# Altium schematic sheet SCH.SchDoc
size C
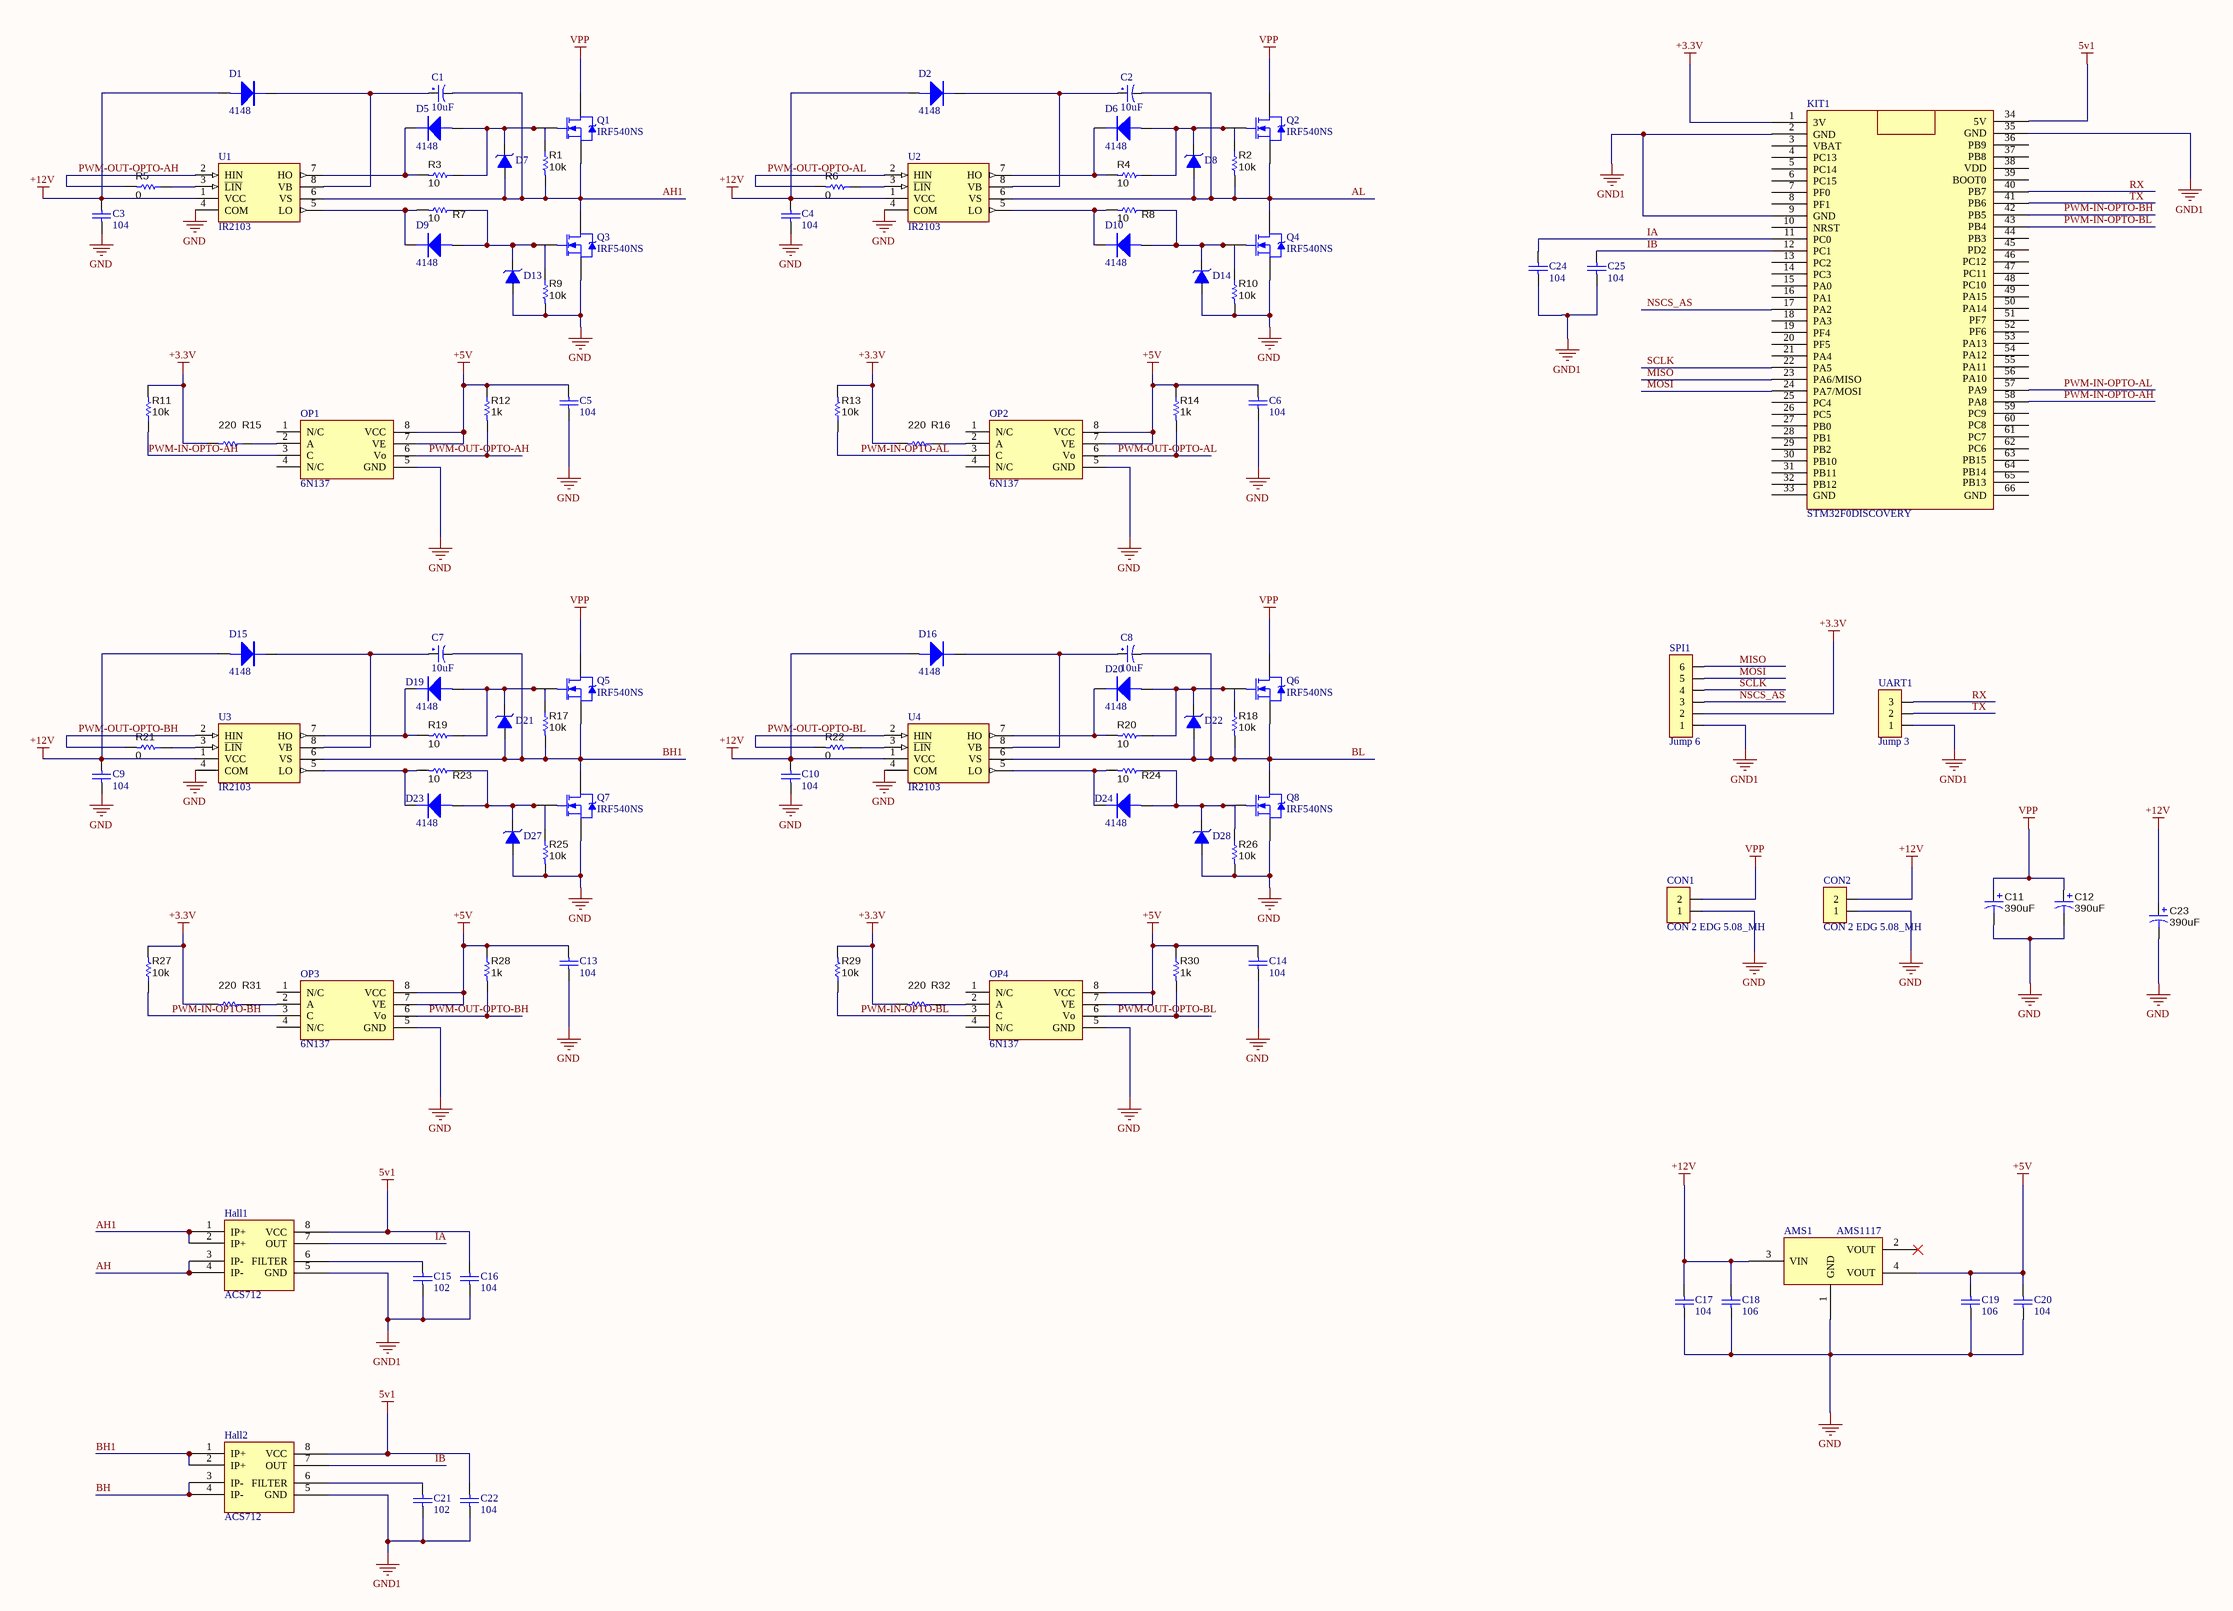
[diagram p0: SCH.SchDoc]

## Parts
AMS1  AMS1117  [SOT223]
C1  10uF  [CP1/2]
C2  10uF  [CP1/2]
C3  104  [TU_SMD_0805]
C4  104  [TU_SMD_0805]
C5  104  [TU_SMD_0805]
C6  104  [TU_SMD_0805]
C7  10uF  [CP1/2]
C8  10uF  [CP1/2]
C9  104  [TU_SMD_0805]
C10  104  [TU_SMD_0805]
C11  390uF  [CAP_12.5 X 25]
C12  390uF  [CAP_12.5 X 25]
C13  104  [TU_SMD_0805]
C14  104  [TU_SMD_0805]
C15  102  [TU_SMD_0805]
C16  104  [TU_SMD_0805]
C17  104  [TU_SMD_0805]
C18  106  [TU_SMD_0805]
C19  106  [TU_SMD_0805]
C20  104  [TU_SMD_0805]
C21  102  [TU_SMD_0805]
C22  104  [TU_SMD_0805]
C23  390uF  [CP1/3.0]
C24  104  [TU_SMD_0805]
C25  104  [TU_SMD_0805]
CON1  CON 2 EDG 5.08_MH  [CON 2 EDG 5.08]
CON2  CON 2 EDG 5.08_MH  [CON 2 EDG 5.08]
D1  4148  [Diode Zener 1N5363B 5W 30V]
D2  4148  [Diode Zener 1N5363B 5W 30V]
D5  4148  [Diode Zener 1N5363B 5W 30V]
D6  4148  [Diode Zener 1N5363B 5W 30V]
D7  (no value)  [DO-35]
D8  (no value)  [DO-35]
D9  4148  [Diode Zener 1N5363B 5W 30V]
D10  4148  [Diode Zener 1N5363B 5W 30V]
D13  (no value)  [DO-35]
D14  (no value)  [DO-35]
D15  4148  [Diode Zener 1N5363B 5W 30V]
D16  4148  [Diode Zener 1N5363B 5W 30V]
D19  4148  [Diode Zener 1N5363B 5W 30V]
D20  4148  [Diode Zener 1N5363B 5W 30V]
D21  (no value)  [DO-35]
D22  (no value)  [DO-35]
D23  4148  [Diode Zener 1N5363B 5W 30V]
D24  4148  [Diode Zener 1N5363B 5W 30V]
D27  (no value)  [DO-35]
D28  (no value)  [DO-35]
Hall1  ACS712  [SOP 8]
Hall2  ACS712  [SOP 8]
KIT1  STM32F0DISCOVERY  [STM32F0DISCOVERY-6N137]
OP1  6N137 DIP8 Opto 10Mbit  [DIP8]  (value not drawn)
OP2  6N137 DIP8 Opto 10Mbit  [DIP8]  (value not drawn)
OP3  6N137 DIP8 Opto 10Mbit  [DIP8]  (value not drawn)
OP4  6N137 DIP8 Opto 10Mbit  [DIP8]  (value not drawn)
Q1  IRF540NS  [D2PAK_M_1]
Q2  IRF540NS  [D2PAK_M_1]
Q3  IRF540NS  [D2PAK_M_1]
Q4  IRF540NS  [D2PAK_M_1]
Q5  IRF540NS  [D2PAK_M_1]
Q6  IRF540NS  [D2PAK_M_1]
Q7  IRF540NS  [D2PAK_M_1]
Q8  IRF540NS  [D2PAK_M_1]
R1  10k  [Tro SMD 0805]
R2  10k  [Tro SMD 0805]
R3  10  [Tro SMD 0805]
R4  10  [Tro SMD 0805]
R5  0  [Tro SMD 0805]
R6  0  [Tro SMD 0805]
R7  10  [Tro SMD 0805]
R8  10  [Tro SMD 0805]
R9  10k  [Tro SMD 0805]
R10  10k  [Tro SMD 0805]
R11  10k  [Tro SMD 0805]
R12  1k  [Tro SMD 0805]
R13  10k  [Tro SMD 0805]
R14  1k  [Tro SMD 0805]
R15  220  [Tro SMD 0805]
R16  220  [Tro SMD 0805]
R17  10k  [Tro SMD 0805]
R18  10k  [Tro SMD 0805]
R19  10  [Tro SMD 0805]
R20  10  [Tro SMD 0805]
R21  0  [Tro SMD 0805]
R22  0  [Tro SMD 0805]
R23  10  [Tro SMD 0805]
R24  10  [Tro SMD 0805]
R25  10k  [Tro SMD 0805]
R26  10k  [Tro SMD 0805]
R27  10k  [Tro SMD 0805]
R28  1k  [Tro SMD 0805]
R29  10k  [Tro SMD 0805]
R30  1k  [Tro SMD 0805]
R31  220  [Tro SMD 0805]
R32  220  [Tro SMD 0805]
SPI1  Jump 6  [ZH 1.5 6P]
U1  IR2103  [SOP 8]
U2  IR2103  [SOP 8]
U3  IR2103  [SOP 8]
U4  IR2103  [SOP 8]
UART1  Jump 3  [Jump 3]

## Nets
5v1: C16.2 C22.2 Hall1.8(VCC) Hall2.8(VCC) KIT1.34(5V)
+3.3V: KIT1.1(3V) R11.2 R13.2 R15.2 R16.2 R27.2 R29.2 R31.2 R32.2 SPI1.2
+5V: AMS1.4(VOUT) C5.2 C6.2 C13.2 C14.2 C19.2 C20.2 OP1.7(VE) OP1.8(VCC) OP2.7(VE) OP2.8(VCC) OP3.7(VE) OP3.8(VCC) OP4.7(VE) OP4.8(VCC) R12.1 R14.1 R28.1 R30.1
+12V: AMS1.3(VIN) C3.2 C4.2 C9.2 C10.2 C17.2 C18.2 C23.1(+) CON2.2 D1.1 D2.1 D15.1 D16.1 U1.1(VCC) U2.1(VCC) U3.1(VCC) U4.1(VCC)
GND: AMS1.1(GND) C3.1 C4.1 C5.1 C6.1 C9.1 C10.1 C11.2(-) C12.2(-) C13.1 C14.1 C17.1 C18.1 C19.1 C20.1 C23.2(-) CON1.1 CON2.1 D13.1(A) D14.1(A) D27.1(A) D28.1(A) OP1.5(GND) OP2.5(GND) OP3.5(GND) OP4.5(GND) Q3.3(S) Q4.3(S) Q7.3(S) Q8.3(S) R9.2 R10.2 R25.2 R26.2 U1.4(COM) U2.4(COM) U3.4(COM) U4.4(COM)
GND1: C15.1 C16.1 C21.1 C22.1 C24.1 C25.1 Hall1.5(GND) Hall2.5(GND) KIT1.2(GND) KIT1.9(GND) KIT1.35(GND) SPI1.1 UART1.1
VPP: C11.1(+) C12.1(+) CON1.2 Q1.2(D) Q2.2(D) Q5.2(D) Q6.2(D)
AH: Hall1.3(IP-) Hall1.4(IP-)
AH1: C1.2 D7.1(A) Hall1.1(IP+) Hall1.2(IP+) Q1.3(S) Q3.2(D) R1.2 U1.6(VS)
AL: C2.2 D8.1(A) Q2.3(S) Q4.2(D) R2.2 U2.6(VS)
BH: Hall2.3(IP-) Hall2.4(IP-)
BH1: C7.2 D21.1(A) Hall2.1(IP+) Hall2.2(IP+) Q5.3(S) Q7.2(D) R17.2 U3.6(VS)
BL: C8.2 D22.1(A) Q6.3(S) Q8.2(D) R18.2 U4.6(VS)
IA: C24.2 Hall1.7(OUT) KIT1.11(PC0)
IB: C25.2 Hall2.7(OUT) KIT1.12(PC1)
MISO: KIT1.23(PA6/MISO) SPI1.6
MOSI: KIT1.24(PA7/MOSI) SPI1.5
NSCS_AS: KIT1.17(PA2) SPI1.3
PWM-IN-OPTO-AH: KIT1.58(PA8) OP1.3(C) R11.1
PWM-IN-OPTO-AL: KIT1.57(PA9) OP2.3(C) R13.1
PWM-IN-OPTO-BH: KIT1.42(PB5) OP3.3(C) R27.1
PWM-IN-OPTO-BL: KIT1.43(PB4) OP4.3(C) R29.1
PWM-OUT-OPTO-AH: OP1.6(Vo) R5.2 R12.2 U1.2(HIN)
PWM-OUT-OPTO-AL: OP2.6(Vo) R6.2 R14.2 U2.2(HIN)
PWM-OUT-OPTO-BH: OP3.6(Vo) R21.2 R28.2 U3.2(HIN)
PWM-OUT-OPTO-BL: OP4.6(Vo) R22.2 R30.2 U4.2(HIN)
RX: KIT1.40(PB7) UART1.3
SCLK: KIT1.22(PA5) SPI1.4
TX: KIT1.41(PB6) UART1.2
NetC1_1: C1.1 D1.2 U1.8(VB)
NetC2_1: C2.1 D2.2 U2.8(VB)
NetC7_1: C7.1 D15.2 U3.8(VB)
NetC8_1: C8.1 D16.2 U4.8(VB)
NetC15_2: C15.2 Hall1.6(FILTER)
NetC21_2: C21.2 Hall2.6(FILTER)
NetD5_1: D5.1 D7.2(K) Q1.1(G) R1.1 R3.1
NetD5_2: D5.2 R3.2 U1.7(HO)
NetD6_1: D6.1 D8.2(K) Q2.1(G) R2.1 R4.1
NetD6_2: D6.2 R4.2 U2.7(HO)
NetD9_1: D9.1 D13.2(K) Q3.1(G) R7.1 R9.1
NetD9_2: D9.2 R7.2 U1.5(LO)
NetD10_1: D10.1 D14.2(K) Q4.1(G) R8.1 R10.1
NetD10_2: D10.2 R8.2 U2.5(LO)
NetD19_1: D19.1 D21.2(K) Q5.1(G) R17.1 R19.1
NetD19_2: D19.2 R19.2 U3.7(HO)
NetD20_1: D20.1 D22.2(K) Q6.1(G) R18.1 R20.1
NetD20_2: D20.2 R20.2 U4.7(HO)
NetD23_1: D23.1 D27.2(K) Q7.1(G) R23.1 R25.1
NetD23_2: D23.2 R23.2 U3.5(LO)
NetD24_1: D24.1 D28.2(K) Q8.1(G) R24.1 R26.1
NetD24_2: D24.2 R24.2 U4.5(LO)
NetOP1_2: OP1.2(A) R15.1
NetOP2_2: OP2.2(A) R16.1
NetOP3_2: OP3.2(A) R31.1
NetOP4_2: OP4.2(A) R32.1
NetR5_1: R5.1 U1.3(~{LIN})
NetR6_1: R6.1 U2.3(~{LIN})
NetR21_1: R21.1 U3.3(~{LIN})
NetR22_1: R22.1 U4.3(~{LIN})

Not connected (* = marked no-connect by the designer): AMS1 2(VOUT)*; KIT1 3(VBAT) 4(PC13) 5(PC14) 6(PC15) 7(PF0) 8(PF1) 10(NRST) 13(PC2) 14(PC3) 15(PA0) 16(PA1) 18(PA3) 19(PF4) 20(PF5) 21(PA4) 25(PC4) 26(PC5) 27(PB0) 28(PB1) 29(PB2) 30(PB10) 31(PB11) 32(PB12) 33(GND) 36(PB9) 37(PB8) 38(VDD) 39(BOOT0) 44(PB3) 45(PD2) 46(PC12) 47(PC11) 48(PC10) 49(PA15) 50(PA14) 51(PF7) 52(PF6) 53(PA13) 54(PA12) 55(PA11) 56(PA10) 59(PC9) 60(PC8) 61(PC7) 62(PC6) 63(PB15) 64(PB14) 65(PB13) 66(GND); OP1 1(N/C) 4(N/C); OP2 1(N/C) 4(N/C); OP3 1(N/C) 4(N/C); OP4 1(N/C) 4(N/C)

## Library data of the parts
AMS1 = AMS1117-3.3V SOT223
C1 C2 C7 C8 = TU_HOA_4.7uF_50V_MH: Cap P  0,1uF < 22uF , 16 - 50V; Value: 10uF/50V; Description 1: 10 => 220uF/6,3V/10V - 10uF => 100uF/16V; Description 2: 0,1uF => 33uF/50V - 10uF => 22uF/63V; Description 3: 0,47uF => 10uF/100V
C3-C6 C9 C10 C13-C22 C24 C25 = Capacitor 0805: Ceramic Chip Capacitor - Standard; Note: Footprint corresponds to dimensions for bulk cassette packaging. This case size has tightened tolerances.; Published: 17-Jul-2002; LatestRevisionDate: 19-Mar-2004; LatestRevisionNote: Silkscreen size reduced.; DatasheetDocument: Mar-2001; PackageDocument: Mar-2001; PackageReference: 0805; Publisher: Altium Limited; Code_JEITA: 0805; Code_IPC: 2012[0805]; ComponentLink1Description: Manufacturer Link; ComponentLink1URL: http://www.kemet.com/; ComponentLink2Description: Datasheet; ComponentLink2URL: http://www.kemet.com/kemet/web/homepage/kechome.nsf/vapubfilesname/F3102TA.pdf/$file/F3102TA.pdf
  C3-C6 C9 C10 C13 C14 C16 C17 C20 C22 C24 C25: Value: 104
  C15 C21: Value: 102
  C18 C19: Value: 106
C11 C12 = Capacitor TuHoa: CAP ALUM 390UF 20% 50V RADIAL; PartNumber: UHW1H391MPD6; Manufacturer: Nichicon; Polarized: Y; U/M: EA; Cap_F: 0.000390; Tolerance_%: 20; Value1: Unknown; VDC_V: 50; TaMin_C: -40; TaMax_C: 105; Cap_Case: 10x22; AEC Category: Q200; AEC Qualified: N; CompType: Capacitor; SymbolVersion: 2008-07-09; Value: 390uF; PackageReference: 10x22; RoHS: Y; Value2: 50V; MountType: TH; Technology: AL; Series: ZL; Publisher: Texas Instruments; LatestRevisionDate: 2015-12-17; ComponentLink1Description: Datasheet link; ComponentLink1URL: http://nichicon-us.com/english/products/pdfs/e-uhw.pdf; Supplier 1: Digi-Key; Supplier Part Number 1: 493-6885-ND; AEC Grade: N/A; ValueDisplayed: 390uF
C23 = Capacitor TuHoa: PartNumber: UHW1H391MPD6; Manufacturer: Nichicon; Polarized: Y; U/M: EA; Cap_F: 0.000390; Tolerance_%: 20; Value1: Unknown; VDC_V: 50; Value2: 50V; TaMin_C: -40; TaMax_C: 105; Cap_Case: 10x22; AEC Category: Q200; AEC Qualified: N; CompType: Capacitor; SymbolVersion: 2008-07-09; Value: 390uF; PackageReference: 10x22; RoHS: Y; MountType: TH; Technology: AL; Series: ZL; Publisher: Texas Instruments; LatestRevisionDate: 2015-12-17; ComponentLink1Description: Datasheet link; ComponentLink1URL: http://nichicon-us.com/english/products/pdfs/e-uhw.pdf; Supplier 1: Digi-Key; Supplier Part Number 1: 493-6885-ND; AEC Grade: N/A; ValueDisplayed: 390uF
CON1 CON2 = CON 2 EDG 5.08_MH: CON 2 EDG 5.08 (xanh cong)
D1 D2 D5 D6 D9 D10 D15 D16 D19 D20 D23 D24 = Diode 1N4148 DO35 450mA 100V ( 1N4148 DIP)_MH: Diode 1N4148 DO35 450mA 100V ( 1N4148 DIP)
D7 D8 D13 D14 D21 D22 D27 D28 = Diode Zener
OP1-OP4 = 6N137: 6N137 DIP8 Opto 10Mbit/s
Q1-Q8 = IRF540NS: HEXFET Power MOSFET; Published: 8-Jun-2000; LatestRevisionDate: 20-Nov-2009; LatestRevisionNote: IPC-7351 Footprint Added.; DatasheetVersion: May-1998; PackageReference: D2PAK; Publisher: Altium Limited; PackageDescription: 3-Pin Transistor Outline Package 2.54 mm Pitch, 15.1 mm Lead Span; ComponentLink1Description: Manufacturer Link; ComponentLink1URL: http://www.irf.com/; ComponentLink2Description: Datasheet; ComponentLink2URL: http://www.irf.com/product-info/datasheets/data/irf540ns.pdf; Supplier 1: Farnell
R1-R32 = R nho: RES, 100, 1%, 0.1 W, 0402; PartNumber: ERJ-2RKF1000X; Manufacturer: Panasonic; CompType: Resistor; Res_ohm: 100; Value_Code: 100R; Tolerance_%: 1; Power_W: 0.1; Value2: 0.1W; VDC_V: 50; TempCo: 100 ppm/C; EIA_Code: E96; U/M: EA; AEC Category: Q200; SymbolVersion: 2009-05-29; PackageReference: 0402; RoHS: Y; Value1: 1%; MountType: SMT; Technology: Thick Film; Published: 2008-06-26; Publisher: Texas Instruments; LatestRevisionDate: 2016-01-08; ComponentLink1Description: Datasheet link; ComponentLink1URL: http://industrial.panasonic.com/www-data/pdf/AOA0000/AOA0000CE2.pdf; Supplier 1: Digi-Key; Supplier Part Number 1: P100LCT-ND; Supplier 2: Mouser; Supplier Part Number 2: 667-ERJ-2RKF1000X; Supplier 3: Farnell; Supplier Part Number 3: 2304034; AEC Qualified: ?
  R1 R2 R9-R11 R13 R17 R18 R25-R27 R29: Value: 10k
  R3 R4 R7 R8 R19 R20 R23 R24: Value: 10
  R5 R6 R21 R22: Value: 0
  R12 R14 R28 R30: Value: 1k
  R15 R16 R31 R32: Value: 220
SPI1 = Jump 6: Jump 6P 2.54
U1-U4 = IR2103: High and Low Side Driver; Published: 8-Jun-2000; LatestRevisionDate: 04-Mar-2005; LatestRevisionNote: Stylized 3D Model Added.; DatasheetVersion: PD600451; PackageReference: PDIP8; Publisher: Altium Limited; PackageDescription: DIP; 8 Leads; Row Spacing 7.62 mm; Pitch 2.54 mm; Code_JEDEC: MO-001-AN; ComponentLink1Description: Manufacturer Link; ComponentLink1URL: http://www.irf.com/; ComponentLink2Description: Datasheet; ComponentLink2URL: http://www.irf.com/product-info/datasheets/data/ir2103.pdf
UART1 = Jump 3: Jump 3P 2.54